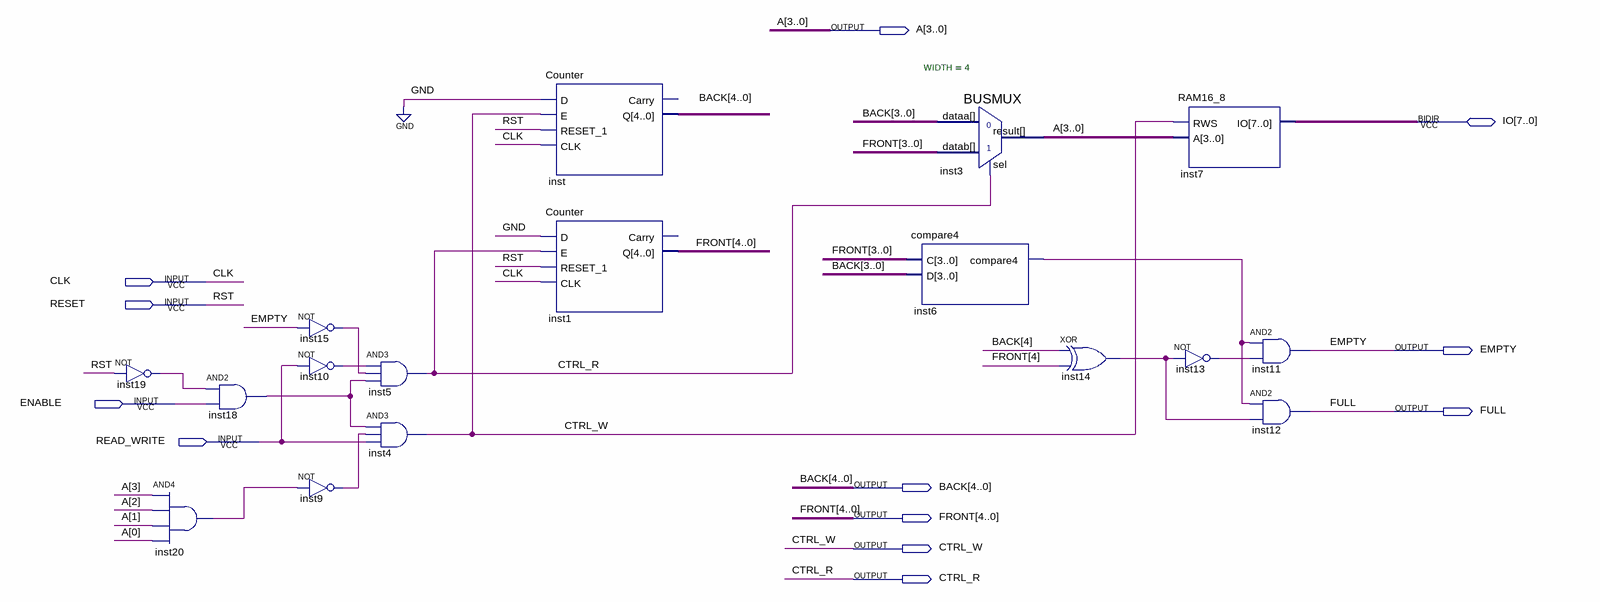
[diagram p0: schematic sheet]
// Quartus schematic NEW_FIFO.bdf as structural Verilog: 17 symbols, 12 pins
module NEW_FIFO (
  input  CLK,
  input  RESET,
  input  ENABLE,
  input  READ_WRITE,
  inout  [7:0] IO,
  output [3:0] A,
  output EMPTY,
  output FULL,
  output [4:0] BACK,
  output [4:0] FRONT,
  output CTRL_W,
  output CTRL_R
);

  wire inst6_compare4, inst9_out, inst10_out, inst13_out, inst14_out, inst15_out, inst18_out, inst19_out,
       inst20_out;

  not inst19 (inst19_out, RESET);
  and inst20 (inst20_out, A[3], A[2], A[1], A[0]);
  and inst18 (inst18_out, inst19_out, ENABLE);
  not inst15 (inst15_out, EMPTY);
  not inst10 (inst10_out, READ_WRITE);
  not inst9 (inst9_out, inst20_out);
  and inst5 (CTRL_R, inst10_out, inst15_out, inst18_out);
  and inst4 (CTRL_W, inst18_out, inst9_out, READ_WRITE);
  Counter inst (.D(1'b0), .E(CTRL_W), .RESET_1(RESET), .CLK(CLK), .Q(BACK));  // open: Carry
  Counter inst1 (.D(1'b0), .E(CTRL_R), .RESET_1(RESET), .CLK(CLK), .Q(FRONT));  // open: Carry
  BUSMUX #(.WIDTH(4)) inst3 (.datab(FRONT[3:0]), .sel(CTRL_R), .dataa(BACK[3:0]), .result(A));
  compare4 inst6 (.C(FRONT[3:0]), .D(BACK[3:0]), .compare4(inst6_compare4));
  xor inst14 (inst14_out, BACK[4], FRONT[4]);
  RAM16_8 inst7 (.RWS(CTRL_W), .A(A), .IO(IO));
  not inst13 (inst13_out, inst14_out);
  and inst11 (EMPTY, inst6_compare4, inst13_out);
  and inst12 (FULL, inst6_compare4, inst14_out);

  // Other names for the same wires on the sheet: RST = RESET
endmodule
